# Altium schematic sheet AVI_Player.SchDoc
size A
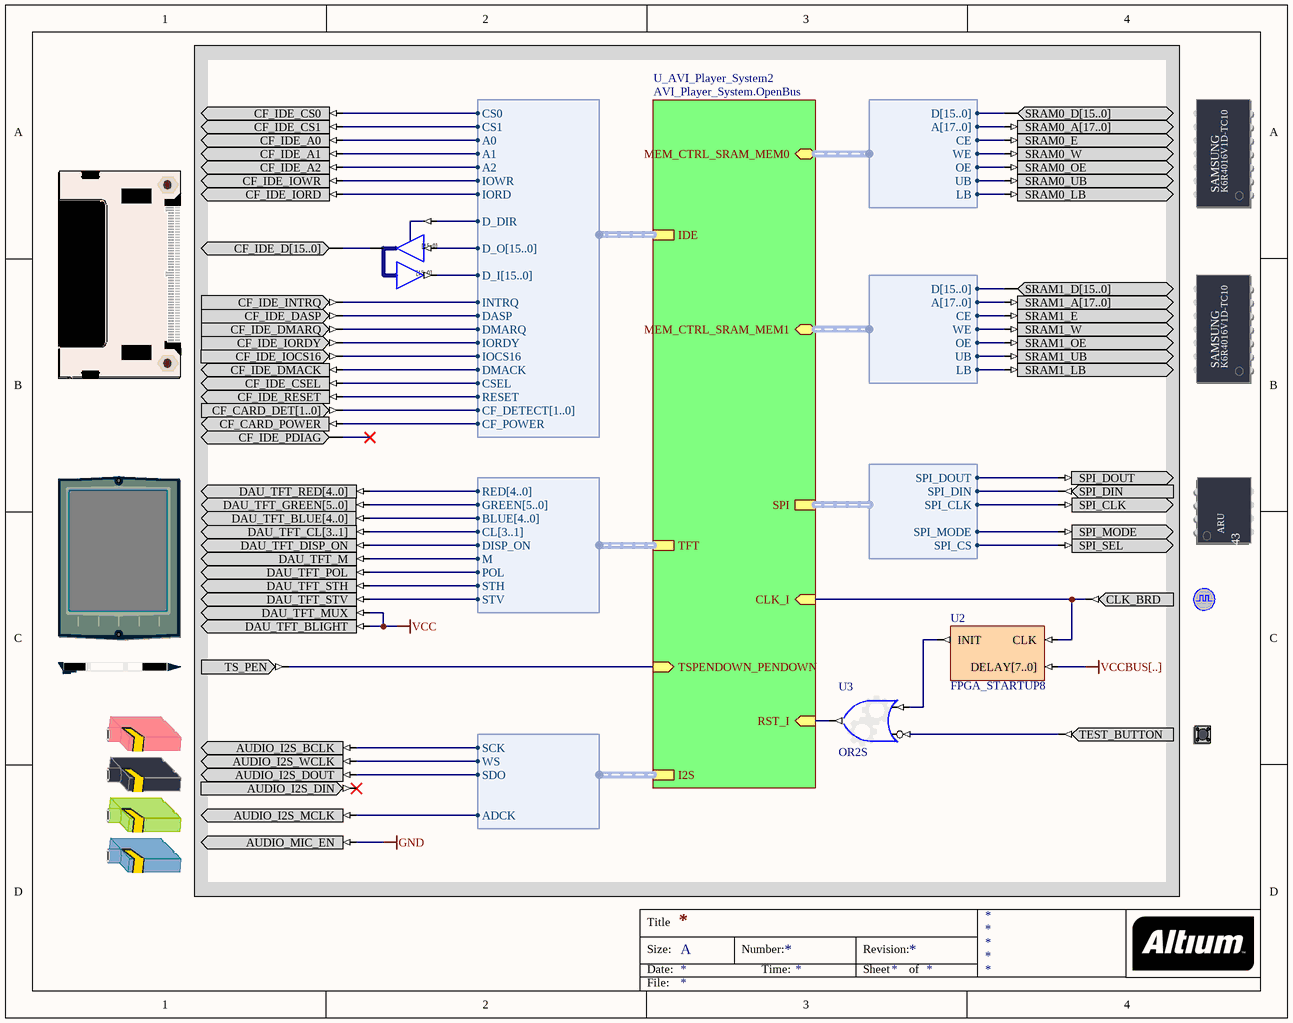
[diagram p0: AVI_Player.SchDoc]

## Parts
(Parts that share a designator on the sheet are numbered #1, #2 ... from top to bottom, then left to right.)
?#1  COMPACT_FLASH  (value not drawn)
?#2  SRAM_DAUGHTER0  (value not drawn)
?#3  SRAM_DAUGHTER1  (value not drawn)
?#4  TFT_LCD  (value not drawn)
?#5  TOUCH_SCREEN_DIGITIZER  (value not drawn)
?#6  CLOCK_BOARD  (value not drawn)
?#7  TOUCHSCREEN_PEN_DOWN  (value not drawn)
?#8  TEST_BUTTON  (value not drawn)
?#9  AUDIO_CODEC  (value not drawn)
U1  IOBUF16B  (value not drawn)
U2  FPGA_STARTUP8
U3  OR2S

## Sub-sheets
U_AVI_Player_System2 = AVI_Player_System.OpenBus: I2S (harness I2S_W_TX), SPI (harness SPI_W_NB), TSPENDOWN_PENDOWN (in), TFT (harness VGA32_TFT), IDE (harness WB_IDE), RST_I (in), CLK_I (in), MEM_CTRL_SRAM_MEM0 (harness WB_MEM_CTRL_SRAM16_A18), MEM_CTRL_SRAM_MEM1 (harness WB_MEM_CTRL_SRAM16_A18)

## Harnesses
WB_IDE: CS0, CS1, A0, A1, A2, IOWR, IORD, D_DIR, D_O[15..0], D_I[15..0], INTRQ, DASP, DMARQ, IORDY, IOCS16, DMACK, CSEL, RESET, CF_DETECT[1..0], CF_POWER
VGA32_TFT: RED[4..0], GREEN[5..0], BLUE[4..0], CL[3..1], DISP_ON, M, POL, STH, STV
SPI_W_NB: SPI_DOUT, SPI_DIN, SPI_CLK, SPI_MODE, SPI_CS
I2S_W_TX: SCK, WS, SDO, ADCK
WB_MEM_CTRL_SRAM16_A18: D[15..0], A[17..0], CE, WE, OE, UB, LB

## Nets
GND: ?#9.AUDIO_MIC_EN
VCC: ?#4.DAU_TFT_BLIGHT ?#4.DAU_TFT_MUX
VCCBUS[..]: U2.DELAY[7..0]
Net?#1_CF_CARD_DET[1..0]: ?#1.CF_CARD_DET[1..0] ; sheet U_AVI_Player_System2/IDE.CF_DETECT[1..0]
Net?#1_CF_CARD_POWER: ?#1.CF_CARD_POWER ; sheet U_AVI_Player_System2/IDE.CF_POWER
Net?#1_CF_IDE_A0: ?#1.CF_IDE_A0 ; sheet U_AVI_Player_System2/IDE.A0
Net?#1_CF_IDE_A1: ?#1.CF_IDE_A1 ; sheet U_AVI_Player_System2/IDE.A1
Net?#1_CF_IDE_A2: ?#1.CF_IDE_A2 ; sheet U_AVI_Player_System2/IDE.A2
Net?#1_CF_IDE_CS0: ?#1.CF_IDE_CS0 ; sheet U_AVI_Player_System2/IDE.CS0
Net?#1_CF_IDE_CS1: ?#1.CF_IDE_CS1 ; sheet U_AVI_Player_System2/IDE.CS1
Net?#1_CF_IDE_CSEL: ?#1.CF_IDE_CSEL ; sheet U_AVI_Player_System2/IDE.CSEL
Net?#1_CF_IDE_D[15..0]: ?#1.CF_IDE_D[15..0] U1.IO[15..0]
Net?#1_CF_IDE_DASP: ?#1.CF_IDE_DASP ; sheet U_AVI_Player_System2/IDE.DASP
Net?#1_CF_IDE_DMACK: ?#1.CF_IDE_DMACK ; sheet U_AVI_Player_System2/IDE.DMACK
Net?#1_CF_IDE_DMARQ: ?#1.CF_IDE_DMARQ ; sheet U_AVI_Player_System2/IDE.DMARQ
Net?#1_CF_IDE_INTRQ: ?#1.CF_IDE_INTRQ ; sheet U_AVI_Player_System2/IDE.INTRQ
Net?#1_CF_IDE_IOCS16: ?#1.CF_IDE_IOCS16 ; sheet U_AVI_Player_System2/IDE.IOCS16
Net?#1_CF_IDE_IORD: ?#1.CF_IDE_IORD ; sheet U_AVI_Player_System2/IDE.IORD
Net?#1_CF_IDE_IORDY: ?#1.CF_IDE_IORDY ; sheet U_AVI_Player_System2/IDE.IORDY
Net?#1_CF_IDE_IOWR: ?#1.CF_IDE_IOWR ; sheet U_AVI_Player_System2/IDE.IOWR
Net?#1_CF_IDE_RESET: ?#1.CF_IDE_RESET ; sheet U_AVI_Player_System2/IDE.RESET
Net?#2_SRAM0_A[17..0]: ?#2.SRAM0_A[17..0] ; sheet U_AVI_Player_System2/MEM_CTRL_SRAM_MEM0.A[17..0]
Net?#2_SRAM0_D[15..0]: ?#2.SRAM0_D[15..0] ; sheet U_AVI_Player_System2/MEM_CTRL_SRAM_MEM0.D[15..0]
Net?#2_SRAM0_E: ?#2.SRAM0_E ; sheet U_AVI_Player_System2/MEM_CTRL_SRAM_MEM0.CE
Net?#2_SRAM0_LB: ?#2.SRAM0_LB ; sheet U_AVI_Player_System2/MEM_CTRL_SRAM_MEM0.LB
Net?#2_SRAM0_OE: ?#2.SRAM0_OE ; sheet U_AVI_Player_System2/MEM_CTRL_SRAM_MEM0.OE
Net?#2_SRAM0_UB: ?#2.SRAM0_UB ; sheet U_AVI_Player_System2/MEM_CTRL_SRAM_MEM0.UB
Net?#2_SRAM0_W: ?#2.SRAM0_W ; sheet U_AVI_Player_System2/MEM_CTRL_SRAM_MEM0.WE
Net?#3_SRAM1_A[17..0]: ?#3.SRAM1_A[17..0] ; sheet U_AVI_Player_System2/MEM_CTRL_SRAM_MEM1.A[17..0]
Net?#3_SRAM1_D[15..0]: ?#3.SRAM1_D[15..0] ; sheet U_AVI_Player_System2/MEM_CTRL_SRAM_MEM1.D[15..0]
Net?#3_SRAM1_E: ?#3.SRAM1_E ; sheet U_AVI_Player_System2/MEM_CTRL_SRAM_MEM1.CE
Net?#3_SRAM1_LB: ?#3.SRAM1_LB ; sheet U_AVI_Player_System2/MEM_CTRL_SRAM_MEM1.LB
Net?#3_SRAM1_OE: ?#3.SRAM1_OE ; sheet U_AVI_Player_System2/MEM_CTRL_SRAM_MEM1.OE
Net?#3_SRAM1_UB: ?#3.SRAM1_UB ; sheet U_AVI_Player_System2/MEM_CTRL_SRAM_MEM1.UB
Net?#3_SRAM1_W: ?#3.SRAM1_W ; sheet U_AVI_Player_System2/MEM_CTRL_SRAM_MEM1.WE
Net?#4_DAU_TFT_BLUE[4..0]: ?#4.DAU_TFT_BLUE[4..0] ; sheet U_AVI_Player_System2/TFT.BLUE[4..0]
Net?#4_DAU_TFT_CL[3..1]: ?#4.DAU_TFT_CL[3..1] ; sheet U_AVI_Player_System2/TFT.CL[3..1]
Net?#4_DAU_TFT_DISP_ON: ?#4.DAU_TFT_DISP_ON ; sheet U_AVI_Player_System2/TFT.DISP_ON
Net?#4_DAU_TFT_GREEN[5..0]: ?#4.DAU_TFT_GREEN[5..0] ; sheet U_AVI_Player_System2/TFT.GREEN[5..0]
Net?#4_DAU_TFT_M: ?#4.DAU_TFT_M ; sheet U_AVI_Player_System2/TFT.M
Net?#4_DAU_TFT_POL: ?#4.DAU_TFT_POL ; sheet U_AVI_Player_System2/TFT.POL
Net?#4_DAU_TFT_RED[4..0]: ?#4.DAU_TFT_RED[4..0] ; sheet U_AVI_Player_System2/TFT.RED[4..0]
Net?#4_DAU_TFT_STH: ?#4.DAU_TFT_STH ; sheet U_AVI_Player_System2/TFT.STH
Net?#4_DAU_TFT_STV: ?#4.DAU_TFT_STV ; sheet U_AVI_Player_System2/TFT.STV
Net?#5_SPI_CLK: ?#5.SPI_CLK ; sheet U_AVI_Player_System2/SPI.SPI_CLK
Net?#5_SPI_DIN: ?#5.SPI_DIN ; sheet U_AVI_Player_System2/SPI.SPI_DIN
Net?#5_SPI_DOUT: ?#5.SPI_DOUT ; sheet U_AVI_Player_System2/SPI.SPI_DOUT
Net?#5_SPI_MODE: ?#5.SPI_MODE ; sheet U_AVI_Player_System2/SPI.SPI_MODE
Net?#5_SPI_SEL: ?#5.SPI_SEL ; sheet U_AVI_Player_System2/SPI.SPI_CS
Net?#6_CLK_BRD: ?#6.CLK_BRD U2.CLK ; sheet U_AVI_Player_System2/CLK_I
Net?#7_TS_PEN: ?#7.TS_PEN ; sheet U_AVI_Player_System2/TSPENDOWN_PENDOWN
Net?#8_TEST_BUTTON: ?#8.TEST_BUTTON U3.I1
Net?#9_AUDIO_I2S_BCLK: ?#9.AUDIO_I2S_BCLK ; sheet U_AVI_Player_System2/I2S.SCK
Net?#9_AUDIO_I2S_DOUT: ?#9.AUDIO_I2S_DOUT ; sheet U_AVI_Player_System2/I2S.SDO
Net?#9_AUDIO_I2S_MCLK: ?#9.AUDIO_I2S_MCLK ; sheet U_AVI_Player_System2/I2S.ADCK
Net?#9_AUDIO_I2S_WCLK: ?#9.AUDIO_I2S_WCLK ; sheet U_AVI_Player_System2/I2S.WS
NetU1_I[15..0]: U1.I[15..0] ; sheet U_AVI_Player_System2/IDE.D_O[15..0]
NetU1_O[15..0]: U1.O[15..0] ; sheet U_AVI_Player_System2/IDE.D_I[15..0]
NetU1_T: U1.T ; sheet U_AVI_Player_System2/IDE.D_DIR
NetU2_INIT: U2.INIT U3.I0
NetU3_O: U3.O ; sheet U_AVI_Player_System2/RST_I

Not connected (* = marked no-connect by the designer): ?#1 CF_IDE_PDIAG*; ?#9 AUDIO_I2S_DIN*

## Notes on the sheet
- Title
- Size:
- Date:
- A
- Number:
- Time:
- Revision:
- Sheet
- of
- File:
- (in symbol IOBUF16B) [15..0]
- (in symbol SRAM_DAUGHTER0) SAMSUNG; K6R4016V1D-TC10
- (in symbol SRAM_DAUGHTER1) SAMSUNG; K6R4016V1D-TC10
- (in symbol TOUCH_SCREEN_DIGITIZER) ARU; AD7843

## Library data of the parts
?#1 = COMPACT_FLASH: Connector, Compact Flash Card Ejector 22mm; PortComponent: True; Published: 22-Jan-2007; Publisher: Altium Limited; HelpURL: TR0146 Technical Reference for Altium's Mass Storage Peripheral Board PB02.pdf#page=8
?#2 = SRAM_DAUGHTER0: Free Static RAM - Daughterboard; PortComponent: True; Published: 14-May-2007; Publisher: Altium Limited; HelpURL: TR0149 Technical Reference for Altium's Xilinx Spartan-3 Daughter Board DB30.pdf#page=16
?#3 = SRAM_DAUGHTER1: Free Static RAM - Daughterboard; PortComponent: True; Published: 14-May-2007; Publisher: Altium Limited; HelpURL: TR0149 Technical Reference for Altium's Xilinx Spartan-3 Daughter Board DB30.pdf#page=16
?#4 = TFT_LCD: TFT LCD Panel; PortComponent: True; Published: 22-Jan-2007; Publisher: Altium Limited; HelpURL: TR0143 Technical Reference Manual for Altium's Desktop NanoBoard NB2DSK01.pdf#page=50
?#5 = TOUCH_SCREEN_DIGITIZER: Touch Screen Digitizer; PortComponent: True; Published: 22-Jan-2007; Publisher: Altium Limited; HelpURL: TR0143 Technical Reference Manual for Altium's Desktop NanoBoard NB2DSK01.pdf#page=50
?#6 = CLOCK_BOARD: Global System Clock Supply; PortComponent: True; Published: 19-Nov-2003; Publisher: Altium Limited; HelpURL: TR0143 Technical Reference Manual for Altium's Desktop NanoBoard NB2DSK01.pdf#page=41; UseInDSF: True
?#7 = TOUCH_SCREEN_PEN: TFT Touch Screen Pen; PortComponent: True; Published: 22-Jan-2007; Publisher: Altium Limited; HelpURL: TR0143 Technical Reference Manual for Altium's Desktop NanoBoard NB2DSK01.pdf#page=50
?#8 = TEST_BUTTON: Test / Reset Button; PortComponent: True; Published: 19-Nov-2003; Publisher: Altium Limited; HelpURL: TR0143 Technical Reference Manual for Altium's Desktop NanoBoard NB2DSK01.pdf#page=53
?#9 = AUDIO_CODEC: Audio Codec; PortComponent: True; IncludeInDSF: AUDIO_CS4270; Published: 22-Jan-2007; Publisher: Altium Limited; HelpURL: TR0145 Technical Reference for Altium's Audio-Video Peripheral Board PB01.pdf#page=12
U1 = IOBUF16B: 16-Bit Input/Output Buffer, Bus Version; SubClass: IOBUF; Enable: Low; Control: Common Control T; PortSize: 16; ArchiveName: GENERIC; VHDLIB_SIM: GENERIC_LIB; Published: 29-Jan-2004; Publisher: Altium Limited; LastRevisionNo: 1.00.00; HelpURL: CR0118 FPGA Generic Library Guide.pdf#page=292; ComponentLink1URL: CR0125 FPGA Buffer Resource Usage.pdf#page=91; ComponentLink1Description: Core &Resource Usage; FunctionalClass: Buffer; PortStyle: Bus Version
U2 = FPGA_STARTUP8: FPGA Startup With 8 Bit Delay; Published: 9-Dec-2004; Publisher: Altium Limited; HelpURL: CR0119 FPGA_STARTUPx Powerup Delay Unit.pdf; LastRevisionNo: 1.00.00; ComponentLink1Description: Core &Resource Usage; ComponentLink1URL: CR0139 FPGA Peripheral Resource Usage.pdf#page=11
U3 = GATE: Configurable Generic Gate; ConfiguratorName: GENERIC_GATE; ConfigurationParameters: {}Version[1.1]{}GateKind[OR]{}BusInput[False]{}GateInputType[Bit]{}GateOutputOption[Normal]{}BusWidth[8]{}RegisterOutputs[False]{}NegativeClockEdge[False]{}InputCount[2]{}InputInvert0[False]{}InputInvert1[True]{}; LastRevisionNo: 1.00.00; Published: 3-Sep-2008; Publisher: Altium Limited